# Altium schematic sheet 74hc595.SchDoc
size A
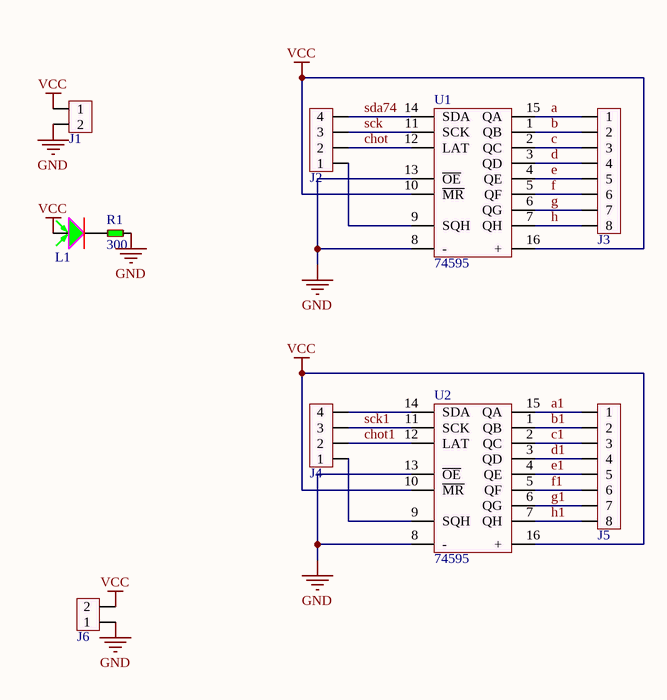
[diagram p0: 74hc595.SchDoc]

## Parts
J1  JP2  [JP2-D1T]  (value not drawn)
J2  JP4  [JP4-C1T]  (value not drawn)
J3  JP8  [JP8-D1T]  (value not drawn)
J4  JP4  [JP4-C1T]  (value not drawn)
J5  JP8  [JP8-D1T]  (value not drawn)
J6  JP2  [JP2-D1T]  (value not drawn)
L1  LED SMD  [L0805R]  (value not drawn)
R1  300  [R0805]
U1  74595  [SO16A]
U2  74595  [SO16A]

## Nets
GND: J1.2 J6.1 R1.1 U1.8(-) U1.13(~{OE}) U2.8(-) U2.13(~{OE})
VCC: J1.1 J6.2 L1.1(A) U1.10(~{MR}) U1.16(+) U2.10(~{MR}) U2.16(+)
a: J3.1 U1.15(QA)
a1: J5.1 U2.15(QA)
b: J3.2 U1.1(QB)
b1: J5.2 U2.1(QB)
c: J3.3 U1.2(QC)
c1: J5.3 U2.2(QC)
chot: J2.2 U1.12(LAT)
chot1: J4.2 U2.12(LAT)
d: J3.4 U1.3(QD)
d1: J5.4 U2.3(QD)
e: J3.5 U1.4(QE)
e1: J5.5 U2.4(QE)
f: J3.6 U1.5(QF)
f1: J5.6 U2.5(QF)
g: J3.7 U1.6(QG)
g1: J5.7 U2.6(QG)
h: J3.8 U1.7(QH)
h1: J5.8 U2.7(QH)
sck: J2.3 U1.11(SCK)
sck1: J4.3 U2.11(SCK)
sda74: J2.4 U1.14(SDA)
NetJ2_1: J2.1 U1.9(SQH)
NetJ4_1: J4.1 U2.9(SQH)
NetJ4_4: J4.4 U2.14(SDA)
NetL1_2: L1.2(K) R1.2

## Library data of the parts
J1 J6 = JP2: WR-PHD 2.54 mm Angled Socket Header
J2 J4 = JP4: WR-PHD 2.54 mm Angled Socket Header
J3 J5 = JP8: WR-PHD 2.54 mm Angled Socket Header
L1 = LED SMD: LED DIFFUSED 1206 SMD
R1 = Res-SMD: RES SMD 0.0 OHM JUMPER 1/8W 0805
U1 U2 = 74595: NXP         74HC595N             Shift Register, Serial to Parallel, Serial to Serial, 1 Element, DIP, 16 Pins, 2 V, 6 V